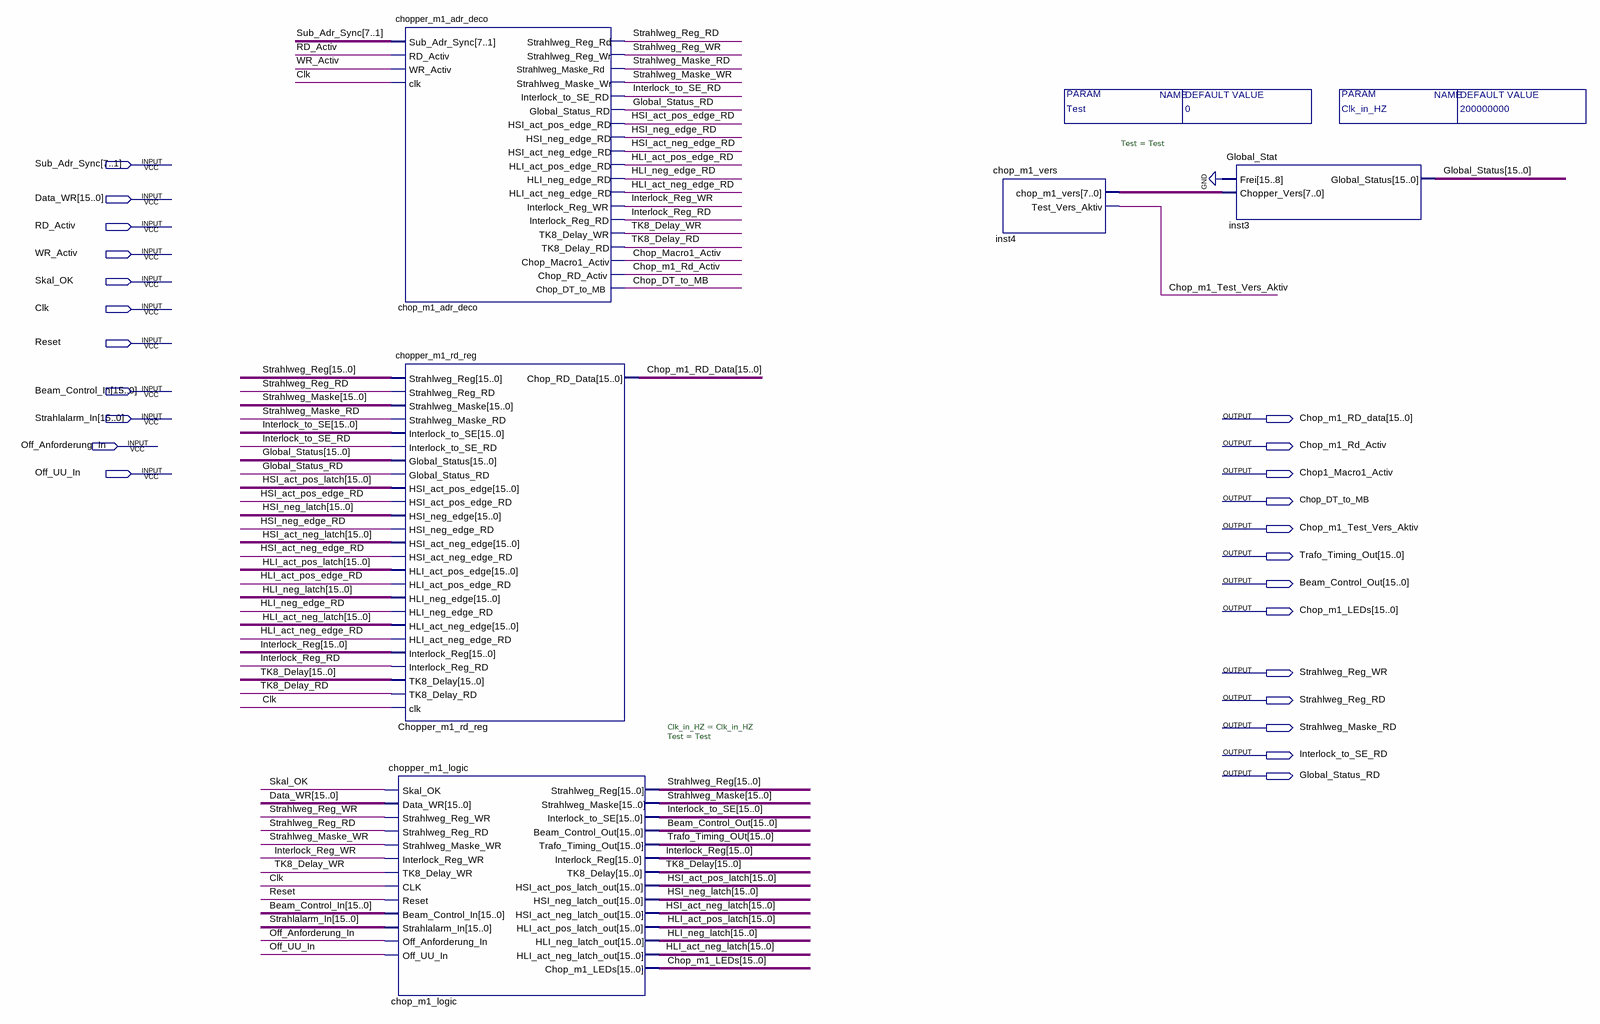
[diagram p0: schematic sheet]
// Quartus schematic chopper_macro1.bdf as structural Verilog: 5 symbols, 24 pins
module chopper_macro1 #(parameter Test = 0, parameter Clk_in_HZ = 200000000) (
  input  [7:1] Sub_Adr_Sync,
  input  [15:0] Data_WR,
  input  RD_Activ,
  input  WR_Activ,
  input  Skal_OK,
  input  Clk,
  input  Reset,
  input  [15:0] Beam_Control_In,
  input  [15:0] Strahlalarm_In,
  input  Off_Anforderung_In,
  input  Off_UU_In,
  output [15:0] Chop_m1_RD_data,
  output Chop_m1_Rd_Activ,
  output Chop1_Macro1_Activ,
  output Chop_DT_to_MB,
  output Chop_m1_Test_Vers_Aktiv,
  output [15:0] Trafo_Timing_Out,
  output [15:0] Beam_Control_Out,
  output [15:0] Chop_m1_LEDs,
  output Strahlweg_Reg_WR,
  output Strahlweg_Reg_RD,
  output Strahlweg_Maske_RD,
  output Interlock_to_SE_RD,
  output Global_Status_RD
);

  wire Chop_Macro1_Activ, HLI_act_neg_edge_RD, HLI_act_pos_edge_RD, HLI_neg_edge_RD, HSI_act_neg_edge_RD,
       HSI_act_pos_edge_RD, HSI_neg_edge_RD, Interlock_Reg_RD, Interlock_Reg_WR, Strahlweg_Maske_WR,
       TK8_Delay_RD, TK8_Delay_WR;
  wire [7:0] inst4_chop_m1_vers;
  wire [15:0] Global_Status, HLI_act_neg_latch, HLI_act_pos_latch, HLI_neg_latch, HSI_act_neg_latch,
       HSI_act_pos_latch, HSI_neg_latch, Interlock_Reg, Interlock_to_SE, Strahlweg_Maske, Strahlweg_Reg,
       TK8_Delay;

  chopper_m1_adr_deco chop_m1_adr_deco (
    .Sub_Adr_Sync(Sub_Adr_Sync), .RD_Activ(RD_Activ), .WR_Activ(WR_Activ), .clk(Clk),
    .Strahlweg_Reg_Rd(Strahlweg_Reg_RD), .Strahlweg_Reg_Wr(Strahlweg_Reg_WR),
    .Strahlweg_Maske_Rd(Strahlweg_Maske_RD), .Strahlweg_Maske_Wr(Strahlweg_Maske_WR),
    .Interlock_to_SE_RD(Interlock_to_SE_RD), .Global_Status_RD(Global_Status_RD),
    .HSI_act_pos_edge_RD(HSI_act_pos_edge_RD), .HSI_neg_edge_RD(HSI_neg_edge_RD),
    .HSI_act_neg_edge_RD(HSI_act_neg_edge_RD), .HLI_act_pos_edge_RD(HLI_act_pos_edge_RD),
    .HLI_neg_edge_RD(HLI_neg_edge_RD), .HLI_act_neg_edge_RD(HLI_act_neg_edge_RD),
    .Interlock_Reg_WR(Interlock_Reg_WR), .Interlock_Reg_RD(Interlock_Reg_RD), .TK8_Delay_WR(TK8_Delay_WR),
    .TK8_Delay_RD(TK8_Delay_RD), .Chop_Macro1_Activ(Chop_Macro1_Activ), .Chop_RD_Activ(Chop_m1_Rd_Activ),
    .Chop_DT_to_MB(Chop_DT_to_MB));
  chopper_m1_rd_reg Chopper_m1_rd_reg (
    .Strahlweg_Reg(Strahlweg_Reg), .Strahlweg_Reg_RD(Strahlweg_Reg_RD), .Strahlweg_Maske(Strahlweg_Maske),
    .Strahlweg_Maske_RD(Strahlweg_Maske_RD), .Interlock_to_SE(Interlock_to_SE),
    .Interlock_to_SE_RD(Interlock_to_SE_RD), .Global_Status(Global_Status),
    .Global_Status_RD(Global_Status_RD), .HSI_act_pos_edge(HSI_act_pos_latch),
    .HSI_act_pos_edge_RD(HSI_act_pos_edge_RD), .HSI_neg_edge(HSI_neg_latch),
    .HSI_neg_edge_RD(HSI_neg_edge_RD), .HSI_act_neg_edge(HSI_act_neg_latch),
    .HSI_act_neg_edge_RD(HSI_act_neg_edge_RD), .HLI_act_pos_edge(HLI_act_pos_latch),
    .HLI_act_pos_edge_RD(HLI_act_pos_edge_RD), .HLI_neg_edge(HLI_neg_latch),
    .HLI_neg_edge_RD(HLI_neg_edge_RD), .HLI_act_neg_edge(HLI_act_neg_latch),
    .HLI_act_neg_edge_RD(HLI_act_neg_edge_RD), .Interlock_Reg(Interlock_Reg),
    .Interlock_Reg_RD(Interlock_Reg_RD), .TK8_Delay(TK8_Delay), .TK8_Delay_RD(TK8_Delay_RD), .clk(Clk),
    .Chop_RD_Data(Chop_m1_RD_data));
  chopper_m1_logic #(.Clk_in_HZ(Clk_in_HZ), .Test(Test)) chop_m1_logic (
    .Skal_OK(Skal_OK), .Data_WR(Data_WR), .Strahlweg_Reg_WR(Strahlweg_Reg_WR),
    .Strahlweg_Reg_RD(Strahlweg_Reg_RD), .Strahlweg_Maske_WR(Strahlweg_Maske_WR),
    .Interlock_Reg_WR(Interlock_Reg_WR), .TK8_Delay_WR(TK8_Delay_WR), .CLK(Clk), .Reset(Reset),
    .Beam_Control_In(Beam_Control_In), .Strahlalarm_In(Strahlalarm_In),
    .Off_Anforderung_In(Off_Anforderung_In), .Off_UU_In(Off_UU_In), .Strahlweg_Reg(Strahlweg_Reg),
    .Strahlweg_Maske(Strahlweg_Maske), .Interlock_to_SE(Interlock_to_SE),
    .Beam_Control_Out(Beam_Control_Out), .Trafo_Timing_Out(Trafo_Timing_Out), .Interlock_Reg(Interlock_Reg),
    .TK8_Delay(TK8_Delay), .HSI_act_pos_latch_out(HSI_act_pos_latch), .HSI_neg_latch_out(HSI_neg_latch),
    .HSI_act_neg_latch_out(HSI_act_neg_latch), .HLI_act_pos_latch_out(HLI_act_pos_latch),
    .HLI_neg_latch_out(HLI_neg_latch), .HLI_act_neg_latch_out(HLI_act_neg_latch), .Chop_m1_LEDs(Chop_m1_LEDs));
  chop_m1_vers #(.Test(Test)) inst4 (.chop_m1_vers(inst4_chop_m1_vers), .Test_Vers_Aktiv(Chop_m1_Test_Vers_Aktiv));
  Global_Stat inst3 (.Frei({8{1'b0}}), .Chopper_Vers(inst4_chop_m1_vers), .Global_Status(Global_Status));
endmodule
